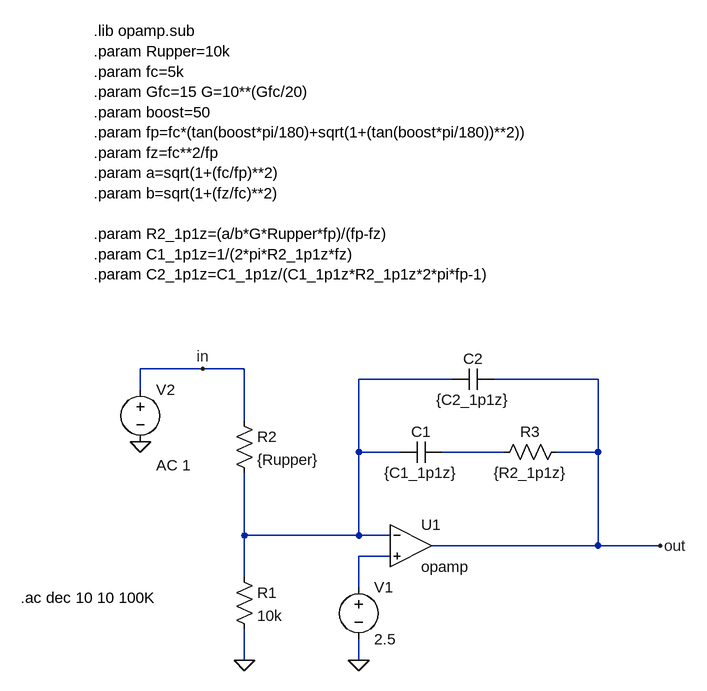
[diagram p0: schematic opa1p1z.asc]
opa1p1z.asc, the LTspice schematic file:
Version 4.1
SHEET 1 1252 680
WIRE 384 64 288 64
WIRE 448 64 384 64
WIRE 768 80 624 80
WIRE 992 80 832 80
WIRE 288 96 288 64
WIRE 448 144 448 64
WIRE 624 192 624 80
WIRE 688 192 624 192
WIRE 848 192 752 192
WIRE 992 192 992 80
WIRE 992 192 928 192
WIRE 448 320 448 224
WIRE 624 320 624 192
WIRE 624 320 448 320
WIRE 672 320 624 320
WIRE 992 336 992 192
WIRE 992 336 736 336
WIRE 1088 336 992 336
WIRE 672 352 624 352
WIRE 448 384 448 320
WIRE 624 400 624 352
WIRE 448 512 448 464
WIRE 624 512 624 480
FLAG 448 512 0
FLAG 624 512 0
FLAG 1088 336 out
FLAG 288 176 0
FLAG 384 64 in
SYMBOL OpAmps\\opamp 704 272 R0
SYMATTR InstName U1
SYMBOL voltage 624 384 R0
WINDOW 123 0 0 Left 0
WINDOW 39 0 0 Left 0
SYMATTR InstName V1
SYMATTR Value 2.5
SYMBOL res 432 368 R0
SYMATTR InstName R1
SYMATTR Value 10k
SYMBOL res 432 128 R0
SYMATTR InstName R2
SYMATTR Value {Rupper}
SYMBOL cap 752 176 R90
WINDOW 0 0 32 VBottom 2
WINDOW 3 32 32 VTop 2
SYMATTR InstName C1
SYMATTR Value {C1_1p1z}
SYMBOL res 944 176 R90
WINDOW 0 0 56 VBottom 2
WINDOW 3 32 56 VTop 2
SYMATTR InstName R3
SYMATTR Value {R2_1p1z}
SYMBOL cap 832 64 R90
WINDOW 0 0 32 VBottom 2
WINDOW 3 32 32 VTop 2
SYMATTR InstName C2
SYMATTR Value {C2_1p1z}
SYMBOL voltage 288 80 R0
WINDOW 123 24 132 Left 2
WINDOW 39 0 0 Left 0
SYMATTR InstName V2
SYMATTR Value ""
SYMATTR Value2 AC 1
TEXT 216 -456 Left 2 !.lib opamp.sub\n.param Rupper=10k\n.param fc=5k\n.param Gfc=15 G=10**(Gfc/20)\n.param boost=50\n.param fp=fc*(tan(boost*pi/180)+sqrt(1+(tan(boost*pi/180))**2))\n.param fz=fc**2/fp\n.param a=sqrt(1+(fc/fp)**2)\n.param b=sqrt(1+(fz/fc)**2)\n \n.param R2_1p1z=(a/b*G*Rupper*fp)/(fp-fz)\n.param C1_1p1z=1/(2*pi*R2_1p1z*fz)\n.param C2_1p1z=C1_1p1z/(C1_1p1z*R2_1p1z*2*pi*fp-1)
TEXT 104 416 Left 2 !.ac dec 10 10 100K

The netlist it stands for:
* opa1p1z.asc
X§U1 N001 N003 out opamp Aol=100K GBW=10Meg  ; pins invin noninvin out
V1 N003 0 2.5
R1 N001 0 10k
R2 in N001 {Rupper}
C1 N002 N001 {C1_1p1z}
R3 out N002 {R2_1p1z}
C2 out N001 {C2_1p1z}
V2 in 0 AC 1
.lib opamp.sub
.param Rupper=10k
.param fc=5k
.param Gfc=15 G=10**(Gfc/20)
.param boost=50
.param fp=fc*(tan(boost*pi/180)+sqrt(1+(tan(boost*pi/180))**2))
.param fz=fc**2/fp
.param a=sqrt(1+(fc/fp)**2)
.param b=sqrt(1+(fz/fc)**2)
.param R2_1p1z=(a/b*G*Rupper*fp)/(fp-fz)
.param C1_1p1z=1/(2*pi*R2_1p1z*fz)
.param C2_1p1z=C1_1p1z/(C1_1p1z*R2_1p1z*2*pi*fp-1)
.ac dec 10 10 100K
.backanno
.end